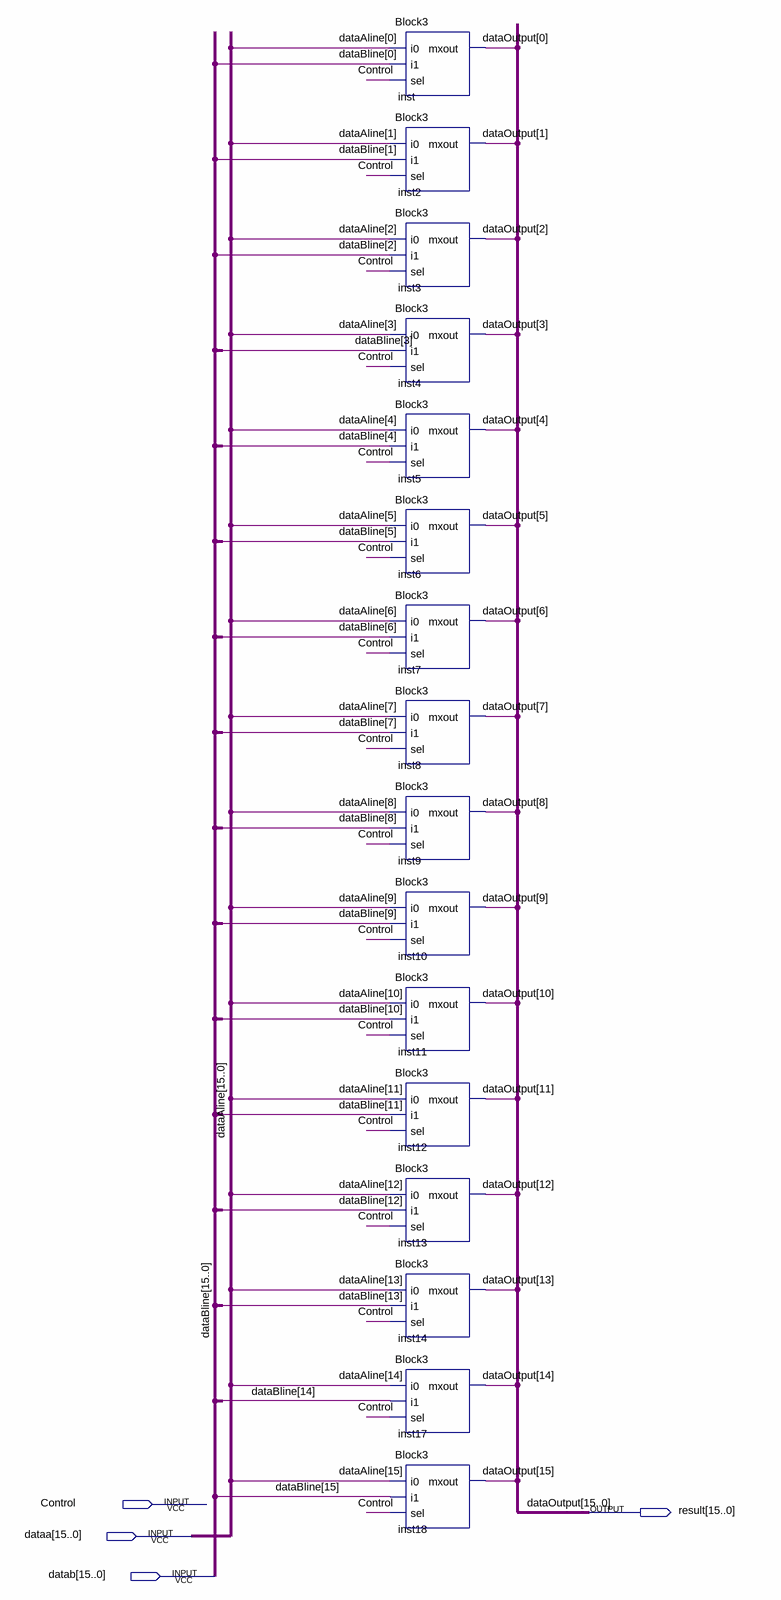
[diagram p0: schematic sheet]
// Quartus schematic SixteenWideBusMux.bdf as structural Verilog: 16 symbols, 4 pins
module SixteenWideBusMux (
  input  Control,
  input  [15:0] dataa,
  input  [15:0] datab,
  output [15:0] result
);

  Block3 inst (.i0(dataa[0]), .i1(datab[0]), .sel(Control), .mxout(result[0]));
  Block3 inst2 (.i0(dataa[1]), .i1(datab[1]), .sel(Control), .mxout(result[1]));
  Block3 inst3 (.i0(dataa[2]), .i1(datab[2]), .sel(Control), .mxout(result[2]));
  Block3 inst4 (.i0(dataa[3]), .i1(datab[3]), .sel(Control), .mxout(result[3]));
  Block3 inst5 (.i0(dataa[4]), .i1(datab[4]), .sel(Control), .mxout(result[4]));
  Block3 inst6 (.i0(dataa[5]), .i1(datab[5]), .sel(Control), .mxout(result[5]));
  Block3 inst7 (.i0(dataa[6]), .i1(datab[6]), .sel(Control), .mxout(result[6]));
  Block3 inst8 (.i0(dataa[7]), .i1(datab[7]), .sel(Control), .mxout(result[7]));
  Block3 inst9 (.i0(dataa[8]), .i1(datab[8]), .sel(Control), .mxout(result[8]));
  Block3 inst10 (.i0(dataa[9]), .i1(datab[9]), .sel(Control), .mxout(result[9]));
  Block3 inst11 (.i0(dataa[10]), .i1(datab[10]), .sel(Control), .mxout(result[10]));
  Block3 inst12 (.i0(dataa[11]), .i1(datab[11]), .sel(Control), .mxout(result[11]));
  Block3 inst13 (.i0(dataa[12]), .i1(datab[12]), .sel(Control), .mxout(result[12]));
  Block3 inst14 (.i0(dataa[13]), .i1(datab[13]), .sel(Control), .mxout(result[13]));
  Block3 inst17 (.i0(dataa[14]), .i1(datab[14]), .sel(Control), .mxout(result[14]));
  Block3 inst18 (.i0(dataa[15]), .i1(datab[15]), .sel(Control), .mxout(result[15]));

  // Other names for the same wires on the sheet: dataAline[15:0] = dataa; dataBline[15:0] = datab;
  //   dataOutput[15:0] = result
endmodule
